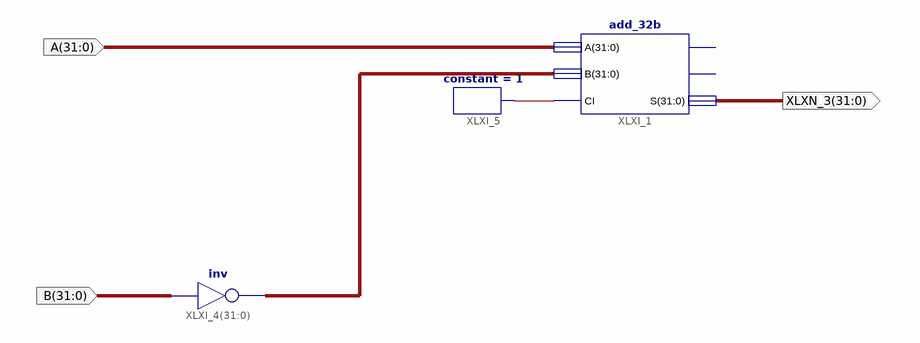
[diagram p0: schematic sheet 1]
// Xilinx ISE schematic sub_32b.sch (spartan3) as structural Verilog: 3 symbols, 3 ports
module sub_32b (
  input  [31:0] A,
  input  [31:0] B,
  output [31:0] XLXN_3
);

  wire XLXN_19;
  wire [31:0] XLXN_7;

  add_32b XLXI_1 (.A(A), .B(XLXN_7), .CI(XLXN_19), .S(XLXN_3));  // open: OFL, CO
  assign XLXN_7 = ~B;  // inv XLXI_4[31..0], 32 bits wide
  constant #(.CValue("1")) XLXI_5 (.O(XLXN_19));
endmodule
